# Altium project PB-F-0212 Fusion- SUPI Payload.PrjPcb
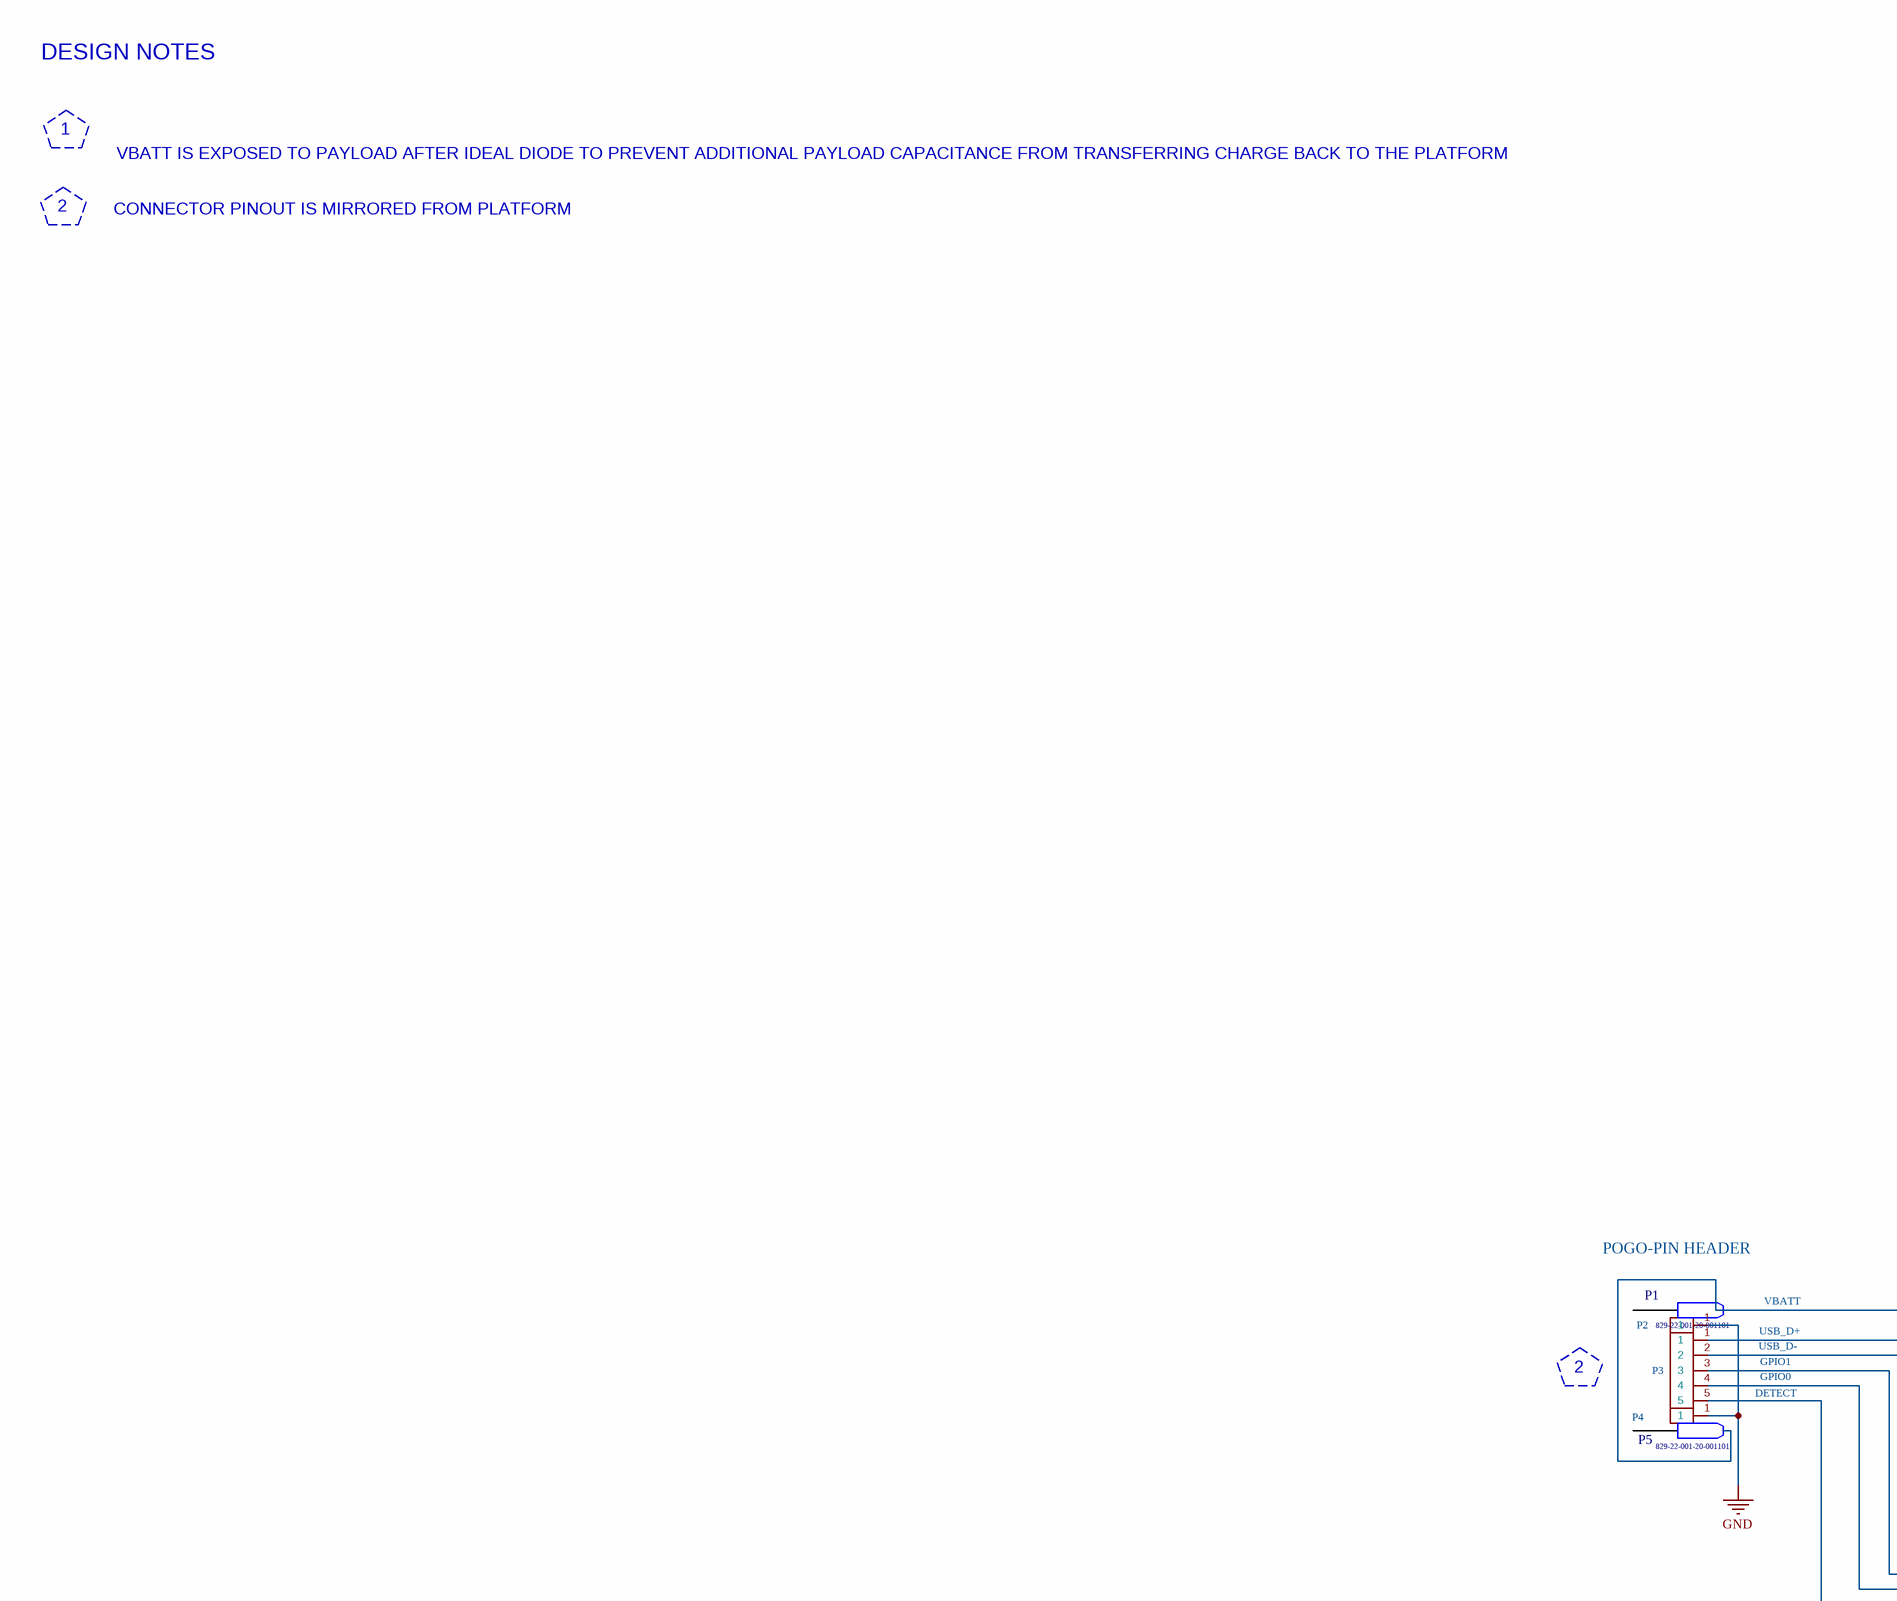
[diagram p0: 100068622_block_diagram.SchDoc, left]
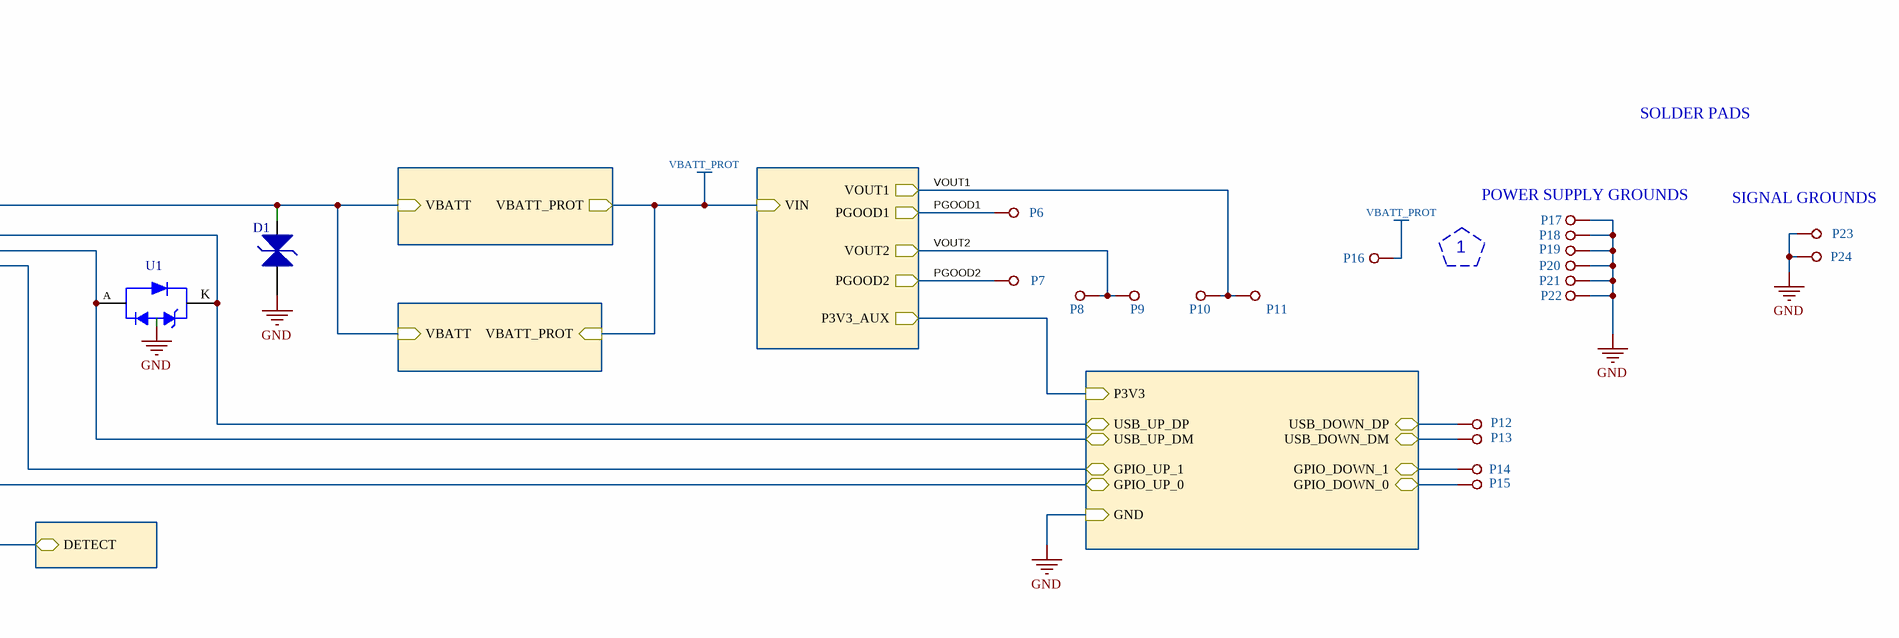
[diagram p1: 100068622_block_diagram.SchDoc, right]
Part_Number: PB-F-0209
6 sheets, 88 parts. Net scope: hierarchical (ports join the sheet entries above them; power ports are global).
Board file: 100068622-001_Rev1.PcbDoc
Sheets:
  100068622_block_diagram.SchDoc
    Power Supplies = 100068622_power_supplies.SchDoc
    Payload Detect = 100068622_payload_detect.SchDoc
    Ideal Diode = 100068622_ideal_diode.SchDoc
    Rail Discharge = 100068622_rail_discharge.SchDoc
    Data Switches = 100068622_data_switches.SchDoc

## Sheet 100068622_block_diagram.SchDoc
size 863 x 558 mm; SheetNumber: 1; SheetTotal: 6

### Parts
D1  SMF26A  [DI-SOD123F-A]  (value not drawn)
P1  (no value)  [829-22-001-20-001101-Footprint-1]
P2  ~  [829-22-001-20-002101]  (value not drawn)
P3  ~  [829-22-005-20-001101]  (value not drawn)
P4  ~  [829-22-001-20-002101]  (value not drawn)
P5  (no value)  [829-22-001-20-001101-Footprint-1]
P6  ~  [Hand_Solder_Pad_100x80_mil]  (value not drawn)
P7  ~  [Hand_Solder_Pad_100x80_mil]  (value not drawn)
P8  ~  [Hand_Solder_Pad_100x80_mil]  (value not drawn)
P9  ~  [Hand_Solder_Pad_100x80_mil]  (value not drawn)
P10  ~  [Hand_Solder_Pad_100x80_mil]  (value not drawn)
P11  ~  [Hand_Solder_Pad_100x80_mil]  (value not drawn)
P12  ~  [Hand_Solder_Pad_100x80_mil]  (value not drawn)
P13  ~  [Hand_Solder_Pad_100x80_mil]  (value not drawn)
P14  ~  [Hand_Solder_Pad_100x80_mil]  (value not drawn)
P15  ~  [Hand_Solder_Pad_100x80_mil]  (value not drawn)
P16  ~  [Hand_Solder_Pad_200x150_mil]  (value not drawn)
P17  ~  [Hand_Solder_Pad_100x80_mil]  (value not drawn)
P18  (no value)  [Hand_Solder_Pad_100x80_mil]
P19  (no value)  [Hand_Solder_Pad_100x80_mil]
P20  (no value)  [Hand_Solder_Pad_100x80_mil]
P21  ~  [Hand_Solder_Pad_100x80_mil]  (value not drawn)
P22  ~  [Hand_Solder_Pad_200x150_mil]  (value not drawn)
P23  ~  [Hand_Solder_Pad_100x80_mil]  (value not drawn)
P24  ~  [Hand_Solder_Pad_100x80_mil]  (value not drawn)
U1  PESD5V0C2UM  [IC-SOT883-2-B]  (value not drawn)

### Sub-sheets
Data Switches = 100068622_data_switches.SchDoc: P3V3 (in), GND (in), USB_DOWN_DP (bidir), USB_DOWN_DM (bidir), USB_UP_DM (bidir), USB_UP_DP (bidir), GPIO_DOWN_1 (bidir), GPIO_DOWN_0 (bidir), GPIO_UP_1 (bidir), GPIO_UP_0 (bidir)
Ideal Diode = 100068622_ideal_diode.SchDoc: VBATT (in), VBATT_PROT (out)
Payload Detect = 100068622_payload_detect.SchDoc: DETECT (bidir)
Power Supplies = 100068622_power_supplies.SchDoc: VIN (in), VOUT1 (out), VOUT2 (out), PGOOD1 (out), PGOOD2 (out), P3V3_AUX (out)
Rail Discharge = 100068622_rail_discharge.SchDoc: VBATT (in), VBATT_PROT (in)

### Nets
GND: D1.A P2.1 P4.1 P17.1 P18.1 P19.1 P20.1 P21.1 P22.1 P23.1 P24.1 ; sheet Data Switches/GND
VBATT_PROT: P16.1 ; sheet Power Supplies/VIN, sheet Ideal Diode/VBATT_PROT, sheet Rail Discharge/VBATT_PROT
DETECT: P3.5 ; sheet Payload Detect/DETECT
PGOOD1: P6.1 ; sheet Power Supplies/PGOOD1
PGOOD2: P7.1 ; sheet Power Supplies/PGOOD2
VOUT1: P10.1 P11.1 ; sheet Power Supplies/VOUT1
VOUT2: P8.1 P9.1 ; sheet Power Supplies/VOUT2
NetC8_2: sheet Power Supplies/P3V3_AUX, sheet Data Switches/P3V3
NetC21_2: D1.K ; sheet Ideal Diode/VBATT, sheet Rail Discharge/VBATT
NetP3_1: P3.1 U1.K ; sheet Data Switches/USB_UP_DP
NetP3_2: P3.2 U1.A ; sheet Data Switches/USB_UP_DM
NetP3_3: P3.3 ; sheet Data Switches/GPIO_UP_1
NetP3_4: P3.4 ; sheet Data Switches/GPIO_UP_0
NetP12_1: P12.1 ; sheet Data Switches/USB_DOWN_DP
NetP13_1: P13.1 ; sheet Data Switches/USB_DOWN_DM
NetP14_1: P14.1 ; sheet Data Switches/GPIO_DOWN_1
NetP15_1: P15.1 ; sheet Data Switches/GPIO_DOWN_0

Not connected (* = marked no-connect by the designer): P1 0; P5 0

### Notes on the sheet
- DESIGN NOTES
- 1
- VBATT IS EXPOSED TO PAYLOAD AFTER IDEAL DIODE TO PREVENT
  ADDITIONAL PAYLOAD CAPACITANCE FROM TRANSFERRING CHARGE
  BACK TO THE PLATFORM
- 2
- CONNECTOR PINOUT IS MIRRORED FROM PLATFORM
- POGO-PIN HEADER
- SOLDER PADS
- (near P17) POWER SUPPLY GROUNDS
- (near P23) SIGNAL GROUNDS
- Labels drawn without touching a wire or pin: GPIO0, GPIO1, USB_D+, USB_D-, VBATT
- DWG NO
- REVISIONS
- SH
- REVISION
- DESCRIPTION
- DATE(YEAR-MO-DA)
- APPROVED
- PART NO.
- DESIGN ACTIVITY
- US ARMY
  COMBAT CAPABILITIES DEVELOPMENT COMMAND ARMAMENTS CENTER
  PICATINNY ARSENAL, NEW JERSEY 07806-5000
- SIZE
- CAGE CODE
- DWG NO.
- D
- 19200
- SCALE
- NONE
- UNIT WT.
- ---
- SHEET
- (in symbol CONN-00404-1) 829-22-001-20-001101

### Library data of the parts
D1 = CMP-00657-1: SMF Series 200 W 26 V Uni-Directional Surface Mount TVS Diode - SOD-123F; Breakdown Voltage: 30.4V; Clamping Voltage: 42.1V; Max Breakdown Voltage: 31.9V; Max Power Dissipation: 1W; Max Reverse Leakage Current: 1µA; Max Surge Current: 4.8A; Min Breakdown Voltage: 28.9V; Number of Channels: 1; Peak Pulse Power: 1kW; Polarity: Unidirectional; Power Line Protection: No; Reverse Standoff Voltage: 26V; Test Current: 1mA; Footprint: 1a_Littelfuse:SOD-123FL; Composition: Zener; Lead Free: Lead Free; Lifecycle Status: Production; Max Operating Temperature: 150°C; Min Operating Temperature: -65°C; Mounting Technology: Surface Mount; Number of Elements: 1; Number of Terminals: 2; Number of Unidirectional Channels: 1; Packaging: Cut Tape; Peak Pulse Current: 4.8A; Peak Reverse Current: 1µA; REACH SVHC: No; Reverse Voltage: 26V; RoHS: Compliant; Schedule B: 8541100080; Termination: SMD/SMT
P1 P5 = CONN-00404-1: Conn Spring Loaded Connector HDR 1 POS Solder RA Thru-Hole 1.14mm MidStroke; Leader Qty: 5; Number of Contacts: 1; Pitch: 2.54mm; Footprint: 1a_MillMax:829-22-001-20-001101; Case/Package: SIP; Contact Gender: Male; Contact Plating: Gold; Country of Origin: USA; Lifecycle Status: Production; Mounting Technology: Through Hole; Number of Rows: 1; System: Connector; Termination: Through Hole
P2 P4 = 829-22-001-20-002101: Manufacturer: Mill-Max; MPN: 829-22-001-20-002101; Footprint: 1a_MillMax:829-22-001-20-002101
P3 = 829-22-005-20-001101: Manufacturer: Mill-Max; MPN: 829-22-005-20-001101; Footprint: 1a_MillMax:829-22-005-20-001101
P6-P15 P17-P21 P23 P24 = Hand_Solder_Pad_100x80_mil: Footprint: 1a_Misc:Hand_Solder_Pad_100x80_mil
P16 P22 = Hand_Solder_Pad_200x100_mil: Footprint: 1a_Misc:Hand_Solder_Pad_200x150_mil
U1 = CMP-00652-1: Extremely low capacitance unidirectional ESD protection diode array; Manufacturer Lifecycle Status: RELEASED FOR SUPPLY; Footprint: Package_DFN_QFN:Diodes_DFN1006-3; Lifecycle Status: Production

## Sheet 100068622_power_supplies.SchDoc
size 863 x 558 mm; SheetNumber: 5; SheetTotal: 6
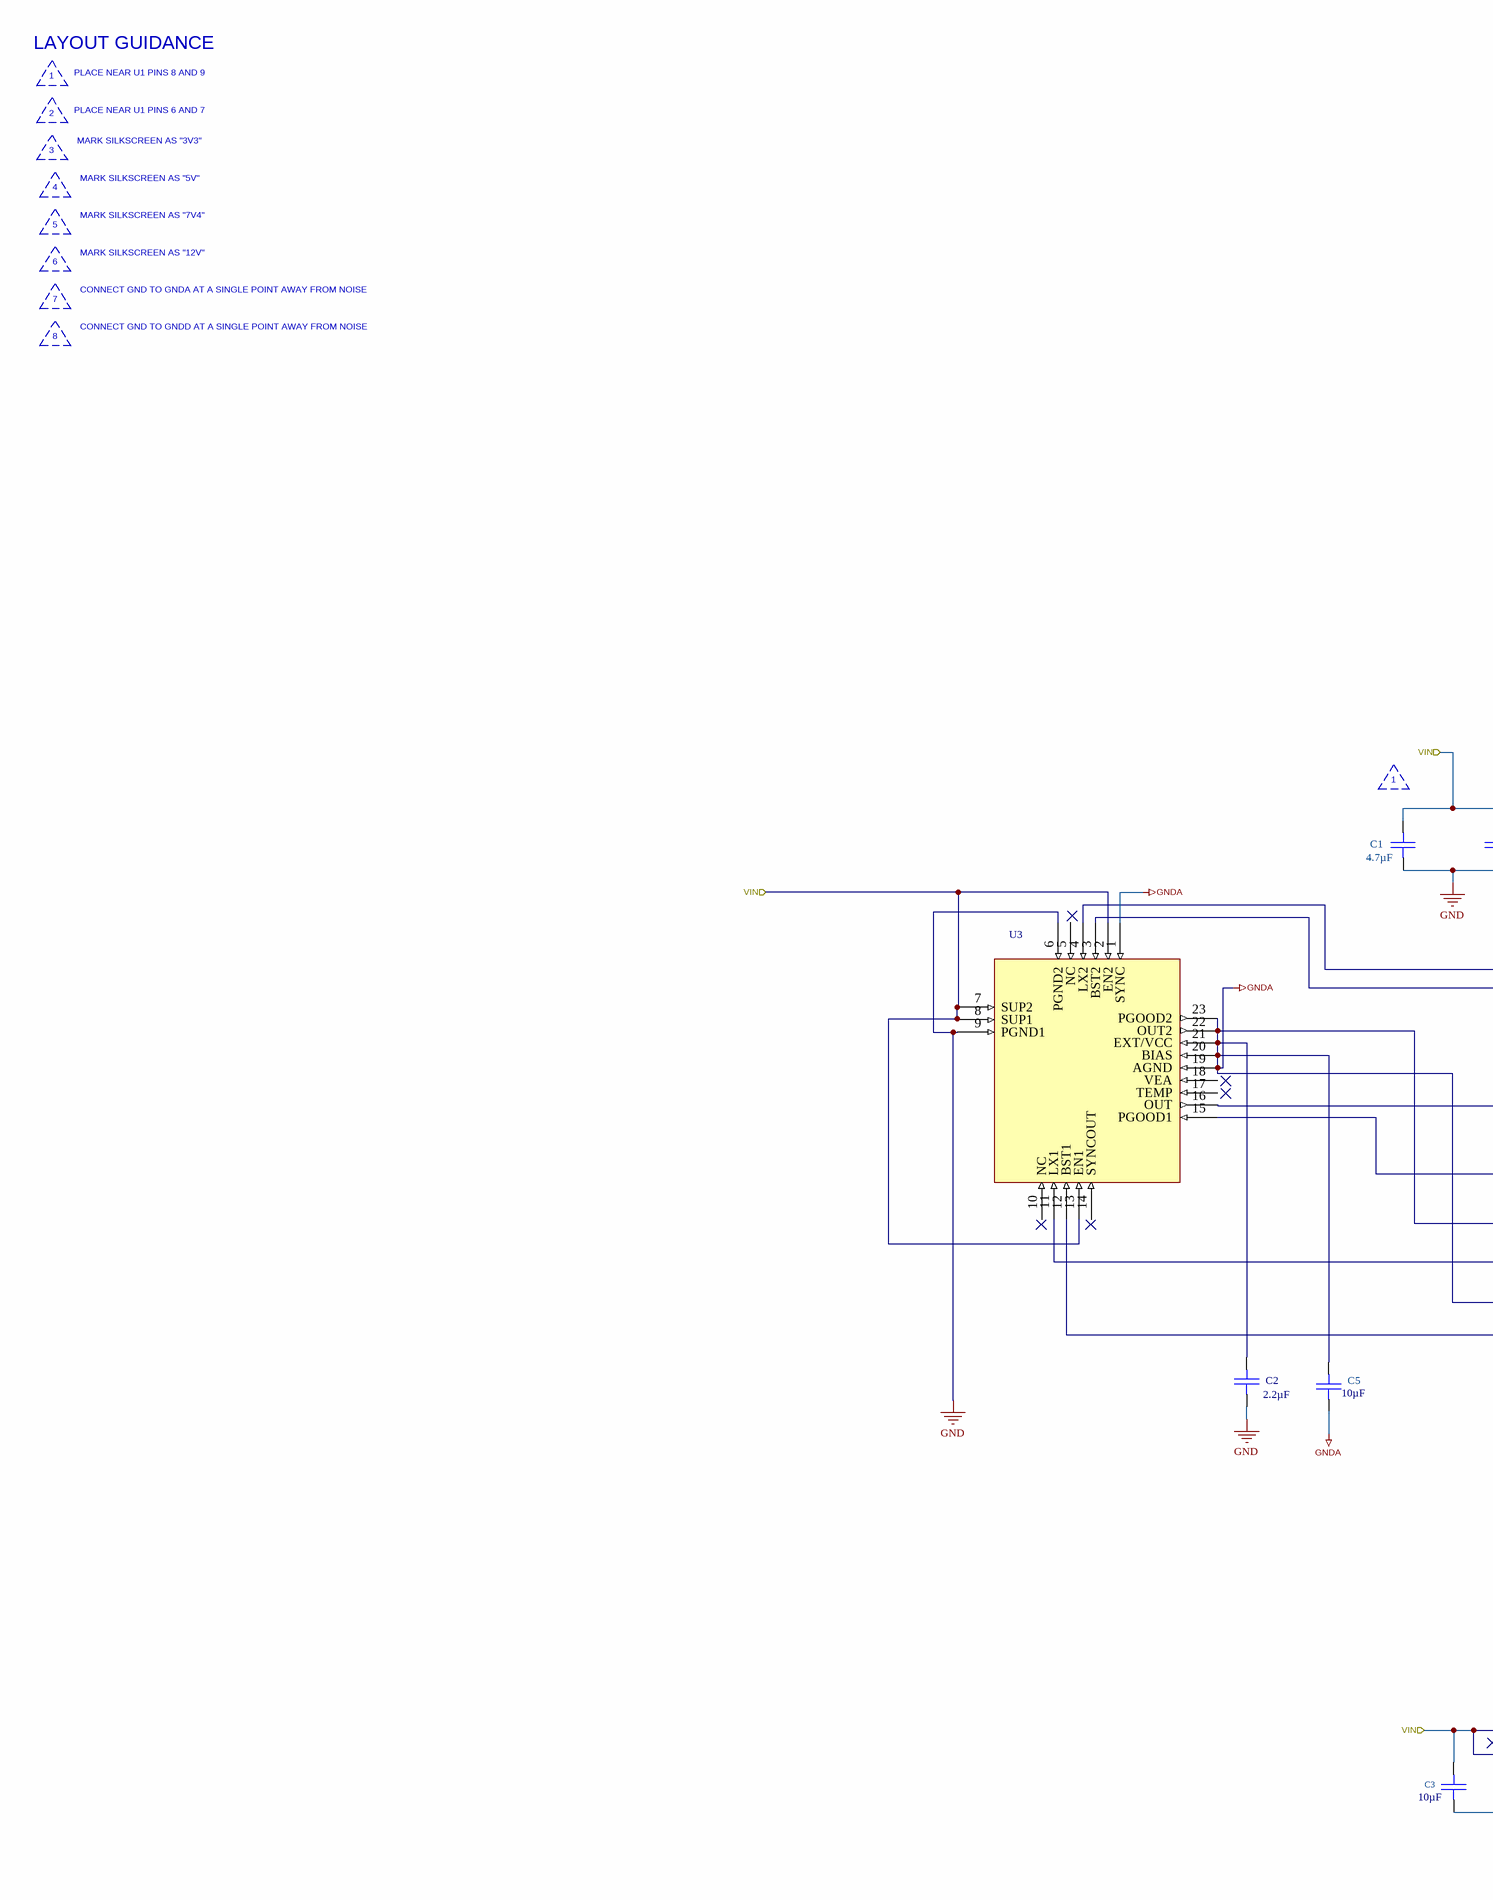
[diagram p2: 100068622_power_supplies.SchDoc, left]
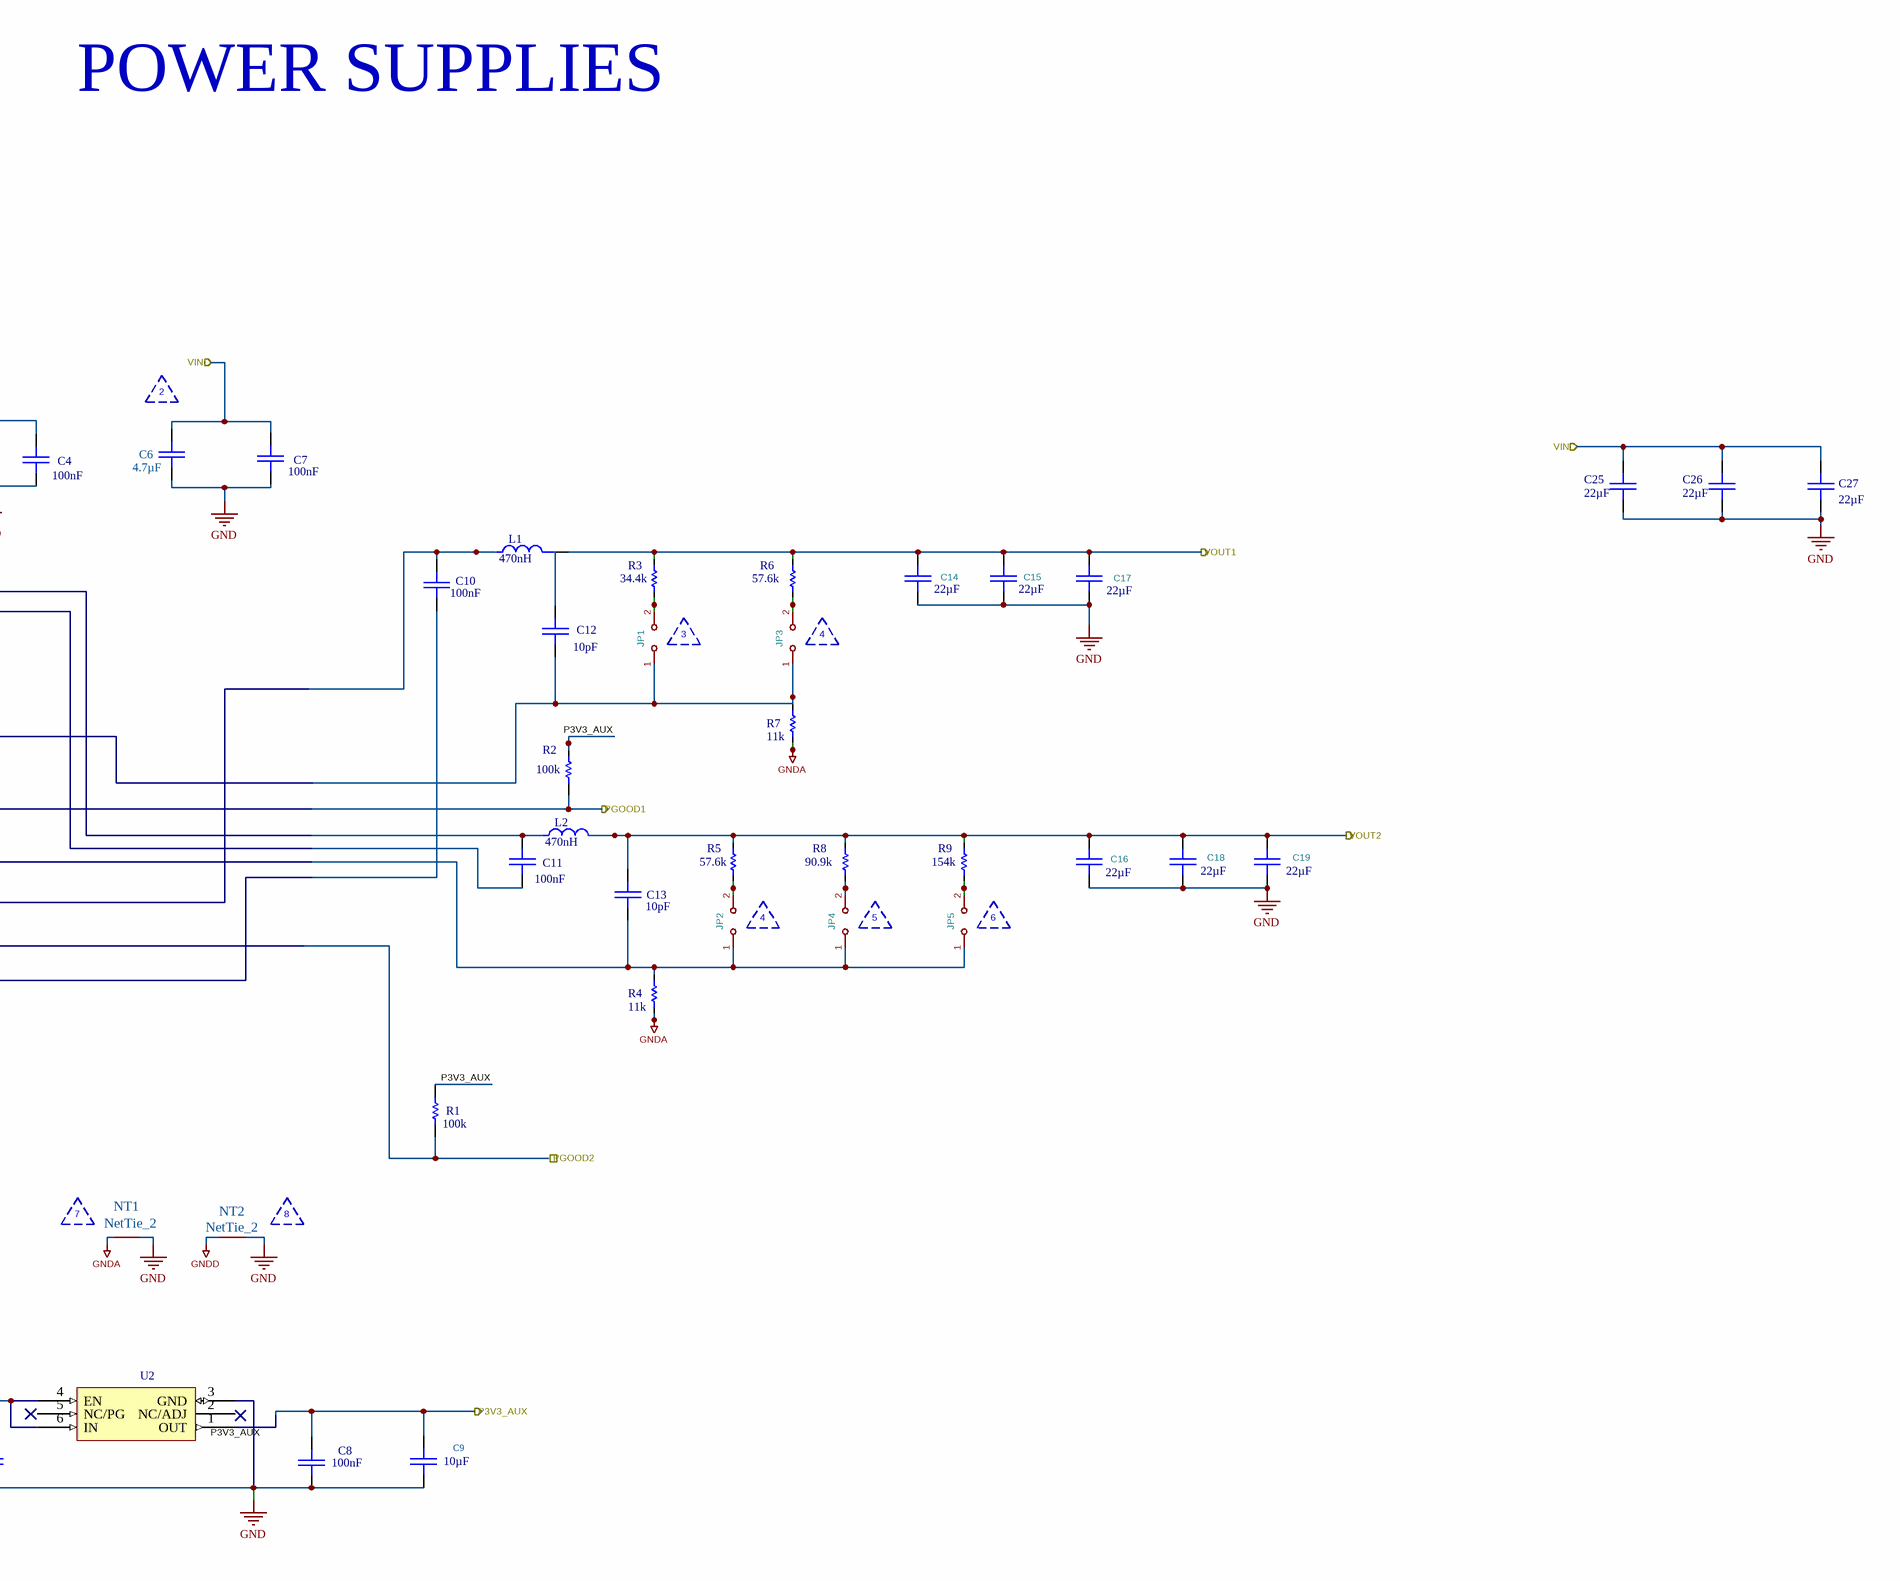
[diagram p3: 100068622_power_supplies.SchDoc, right]

### Parts
C1  value 4.7µF  [CAP-0805-A]  (hidden comment: CAP 0805 4.7UF 50V 10% X7R)
C2  value 2.2µF  [CAP-0402-A]  (hidden comment: CAP 0402 2.2UF 35V 10% X5R)
C3  value 10µF  [CAP-0805-A]  (hidden comment: CAP 0805 10UF 50V 10% X5R)
C4  value 100nF  [CAP-0402-A]  (hidden comment: CAP 0402 0.1UF 50V 10% X5R)
C5  value 10µF  [CAP-0402-A]  (hidden comment: Cap 0402 10uF 10V 20% X5R)
C6  value 4.7µF  [CAP-0805-A]  (hidden comment: CAP 0805 4.7UF 50V 10% X7R)
C7  value 100nF  [CAP-0402-A]  (hidden comment: CAP 0402 0.1UF 50V 10% X5R)
C8  value 100nF  [CAP-0402-A]  (hidden comment: CAP 0402 0.1UF 50V 10% X5R)
C9  value 10µF  [CAP-0402-A]  (hidden comment: Cap 0402 10uF 10V 20% X5R)
C10  value 100nF  [CAP-0402-A]  (hidden comment: CAP 0402 0.1UF 50V 10% X5R)
C11  value 100nF  [CAP-0402-A]  (hidden comment: CAP 0402 0.1UF 50V 10% X5R)
C12  value 10pF  [CAP-0402-A]  (hidden comment: CAP 0402 10pF 50V 2% NPO)
C13  value 10pF  [CAP-0402-A]  (hidden comment: CAP 0402 10pF 50V 2% NPO)
C14  value 22µF  [CAP-0805-A]  (hidden comment: Cap 0805 22uF 25V 20% X5R)
C15  value 22µF  [CAP-0805-A]  (hidden comment: Cap 0805 22uF 25V 20% X5R)
C16  value 22µF  [CAP-0805-A]  (hidden comment: Cap 0805 22uF 25V 20% X5R)
C17  value 22µF  [CAP-0805-A]  (hidden comment: Cap 0805 22uF 25V 20% X5R)
C18  value 22µF  [CAP-0805-A]  (hidden comment: Cap 0805 22uF 25V 20% X5R)
C19  value 22µF  [CAP-0805-A]  (hidden comment: Cap 0805 22uF 25V 20% X5R)
C25  value 22µF  [CAP-0805-A]  (hidden comment: CAP 0805 22UF 35V 20%)
C26  value 22µF  [CAP-0805-A]  (hidden comment: CAP 0805 22UF 35V 20%)
C27  value 22µF  [CAP-0805-A]  (hidden comment: CAP 0805 22UF 35V 20%)
JP1  Jumper_2_Bridged  [SolderJumper-2_P1.3mm_Open_TrianglePad1.0x1.5mm]  (value not drawn)
JP2  Jumper_2_Bridged  [SolderJumper-2_P1.3mm_Open_TrianglePad1.0x1.5mm]  (value not drawn)
JP3  Jumper_2_Open  [SolderJumper-2_P1.3mm_Open_TrianglePad1.0x1.5mm]  (value not drawn)
JP4  Jumper_2_Open  [SolderJumper-2_P1.3mm_Open_TrianglePad1.0x1.5mm]  (value not drawn)
JP5  Jumper_2_Open  [SolderJumper-2_P1.3mm_Open_TrianglePad1.0x1.5mm]  (value not drawn)
L1  value 470nH  [IND-1616-A]  (hidden comment: XEL4030-471MEC)
L2  value 470nH  [IND-1616-A]  (hidden comment: XEL4030-471MEC)
NT1  NetTie_2  [NetTie segment - 10 mils horizontal]
NT2  NetTie_2  [NetTie segment - 10 mils horizontal]
R1  value 100k  [RES-0402-C]  (hidden comment: Res 0402 100K 1/10W 1% Thick Flim)
R2  value 100k  [RES-0402-C]  (hidden comment: Res 0402 100K 1/10W 1% Thick Flim)
R3  value 34.4k  [RES-0402-A]  (hidden comment: RES 0402 34.4K 1/16W 1%)
R4  value 11k  [RES-0402-C]  (hidden comment: RES 0402 11K 1/10W 1%)
R5  value 57.6k  [RES-0402-A]  (hidden comment: RES 0402 57.6K 1/10W 1%)
R6  value 57.6k  [RES-0402-A]  (hidden comment: RES 0402 57.6K 1/10W 1%)
R7  value 11k  [RES-0402-C]  (hidden comment: RES 0402 11K 1/10W 1%)
R8  value 90.9k  [RES-0402-A]  (hidden comment: RES 0402 90.9K 1/10W 1%)
R9  value 154k  [RES-0402-A]  (hidden comment: Res 0402 154K 1/10W 1% Thick Flim)
U2  NCP730BMT330TBG  [IC-WDFN6-B]  (value not drawn)
U3  MAX25254AFDE_VY+  [IC-FC2QFN23-A]  (value not drawn)

### Ports
P3V3_AUX (out), PGOOD1 (out), PGOOD2 (out), VIN (in), VOUT1 (out), VOUT2 (out)

### Nets
GND: C1.1 C2.1 C3.1 C4.1 C6.1 C7.1 C8.1 C9.1 C14.1 C15.1 C16.1 C17.1 C18.1 C19.1 C25.1 C26.1 C27.1 NT1.2 NT2.2 U2.3(GND) U3.6(PGND2) U3.9(PGND1)
GNDA: C2.2 C5.1 C5.2 C13.1 JP2.1(A) JP4.1(A) JP5.1(A) NT1.1 R1.2 R4.1 R4.2 R7.1 U3.1(SYNC) U3.19(AGND) U3.20(BIAS) U3.21(EXT/VCC) U3.22(OUT2) U3.23(PGOOD2)
GNDD: NT2.1
VBATT_PROT: C1.2 C3.2 C4.2 C6.2 C7.2 C25.2 C26.2 C27.2 U2.4(EN) U2.6(IN) U3.2(EN2) U3.7(SUP2) U3.8(SUP1) U3.13(EN1) ; port VIN
P3V3_AUX: R1.1 R2.2
PGOOD1: R2.1 U3.15(PGOOD1) ; port PGOOD1
VOUT1: C14.2 C15.2 C17.2 L1.2 R3.2 R6.2 ; port VOUT1
VOUT2: C13.2 C16.2 C18.2 C19.2 L2.2 R5.2 R8.2 R9.2 ; port VOUT2
NetC8_2: C8.2 C9.2 U2.1(OUT) ; port P3V3_AUX
NetC10_1: C10.1 U3.12(BST1)
NetC10_2: C10.2 L1.1 U3.11(LX1)
NetC11_1: C11.1 U3.3(BST2)
NetC11_2: C11.2 L2.1 U3.4(LX2)
NetC12_1: C12.1 JP1.1(A) JP3.1(A) R7.2 U3.16(OUT)
NetJP1_2: JP1.2(B) R3.1
NetJP2_2: JP2.2(B) R5.1
NetJP3_2: JP3.2(B) R6.1
NetJP4_2: JP4.2(B) R8.1
NetJP5_2: JP5.2(B) R9.1

Not connected (* = marked no-connect by the designer): C12 2; U2 2(NC/ADJ) 5(NC/PG); U3 5(NC) 10(NC) 14(SYNCOUT) 17(TEMP) 18(VEA)

### Notes on the sheet
- LAYOUT GUIDANCE
- 1
- PLACE NEAR U1 PINS 8 AND 9
- 2
- 3
- PLACE NEAR U1 PINS 6 AND 7
- MARK SILKSCREEN AS "3V3"
- 4
- MARK SILKSCREEN AS "5V"
- MARK SILKSCREEN AS "7V4"
- 6
- 5
- MARK SILKSCREEN AS "12V"
- 8
- 7
- CONNECT GND TO GNDA AT A SINGLE POINT AWAY FROM NOISE
- CONNECT GND TO GNDD AT A SINGLE POINT AWAY FROM NOISE
- POWER SUPPLIES
- (near C1) 1
- (near C6) 2
- (near JP1) 3
- (near JP3) 4
- (near JP2) 4
- (near JP4) 5
- (near JP5) 6
- (near NT1) 7
- Labels drawn without touching a wire or pin: P3V3_AUX
- DWG NO
- REVISIONS
- SH
- REVISION
- DESCRIPTION
- DATE(YEAR-MO-DA)
- APPROVED
- PART NO.
- DESIGN ACTIVITY
- US ARMY
  COMBAT CAPABILITIES DEVELOPMENT COMMAND ARMAMENTS CENTER
  PICATINNY ARSENAL, NEW JERSEY 07806-5000
- SIZE
- CAGE CODE
- DWG NO.
- D
- 19200
- SCALE
- NONE
- UNIT WT.
- ---
- SHEET

### Library data of the parts
C1 C6 = CAP-00372-1: Leader Qty: 100; UOM: EA; Footprint: Capacitor_SMD:C_0805_2012Metric; Case/Package: 0805; Max Operating Temperature: 125°C; Min Operating Temperature: -55°C; Mounting Technology: Surface Mount; Voltage Rating: 50V
C2 = CAP-00383-1: Capacitor Type: Ceramic; Leader Qty: 100; UOM: EA; Footprint: Capacitor_SMD:C_0402_1005Metric; Case/Package: 0402; Max Operating Temperature: 85°C; Min Operating Temperature: -55°C; Mounting Technology: Surface Mount; Pins: 2; RoHS Compliant: Yes; Tolerance: 10%; Voltage Rating: 35V
C3 = CAP-00370-1: Leader Qty: 100; UOM: EA; Footprint: Capacitor_SMD:C_0805_2012Metric; Case/Package: 0805; Dielectric: X5R; Max Operating Temperature: 85°C; Min Operating Temperature: -55°C; Mounting Technology: Surface Mount
C4 C7 C8 C10 C11 = CAP-00349-1: Capacitor Type: Ceramic; Leader Qty: 100; UOM: EA; Footprint: Capacitor_SMD:C_0402_1005Metric; Case/Package: 0402; Max Operating Temperature: 85°C; Min Operating Temperature: -55°C; Mounting Technology: Surface Mount; Pins: 2; RoHS Compliant: Yes; Tolerance: 10%; Voltage Rating: 50V
C5 C9 = CAP-00021-6: Capacitor Type: Ceramic; Leader Qty: 100; Footprint: Capacitor_SMD:C_0402_1005Metric; Case/Package: 0402; Max Operating Temperature: 85°C; Min Operating Temperature: -55°C; Mounting Technology: SMT; Pins: 2; RoHS Compliant: Yes; Tolerance: 20%; Voltage Rating: 10V
C12 C13 = CAP-00136-5: Cap Ceramic 10pF 50V C0G 2% Pad SMD 0402 125°C T/R; Leader Qty: 100; Footprint: Capacitor_SMD:C_0402_1005Metric; Case/Package: 0402; Max Operating Temperature: 125°C; Min Operating Temperature: -55°C; RoHS Compliant: Yes; Tolerance: 2%; Voltage Rating: 50V
C14-C19 = CMP-00053-15: Capacitor Type: Ceramic; Leader Qty: 100; Footprint: Capacitor_SMD:C_0805_2012Metric; Case/Package: 0805; Max Operating Temperature: 85°C; Min Operating Temperature: -55°C; Mounting Technology: Surface Mount; Series: -; Tolerance: 20%; Voltage Rating: 25V
C25-C27 = CAP-00374-1: Leader Qty: 100; Material: Ceramic; UOM: EA; Footprint: Capacitor_SMD:C_0805_2012Metric; Case/Package: 0805; Length: 2mm; Max Length: 2.2mm; Max Operating Temperature: 85°C; Min Operating Temperature: -55°C; Mounting Technology: Surface Mount; Tolerance: 20%; Voltage Rating: 35V
L1 L2 = CMP-00659-1: General Purpose Inductor, 0.47uH, 20%, 1 Element, Composite-Core, SMD, 1616; DC Resistance (DCR): 4.6mΩ; Max Current Rating: 15.6A; Number of Circuits: 1; Self Resonant Frequency: 95MHz; Test Frequency: 1MHz; Footprint: 1a_Misc:XEL4030-3.1mm; Case/Package: 1616; Core Material: Composite; Country of Origin: Mainland China; Export Control Classification Number (ECCN) Code: EAR99; Harmonized Tariff Schedule (HTS) Code: 8504.50.80.00; Height: 3.1mm; Introduction Date: 2016-01-23; Lifecycle Status: Production; Max Operating Temperature: 125°C; Min Operating Temperature: -40°C; Number of Terminals: 2; REACH SVHC: Yes; RoHS: Compliant; Tolerance: 20%; Width: 4mm
R1 R2 = RES-00031-9: Leader Qty: 100; Footprint: Resistor_SMD:R_0402_1005Metric; Case/Package: 0402; Max Operating Temperature: 155°C; Min Operating Temperature: -55°C; Mounting Technology: SMT; Pins: 2; RoHS Compliant: Yes; Tolerance: 1%
R3 = RES-00791-1: Leader Qty: 100; UOM: EA; Voltage Rating: 50V; Footprint: Resistor_SMD:R_0402_1005Metric; Case/Package: 0402; Max Operating Temperature: 155°C; Min Operating Temperature: -55°C; Mounting Technology: Surface Mount; Tolerance: 1%
R4 R7 = RES-00793-1: Leader Qty: 100; Power Dissipation: 100mW; UOM: EA; Voltage Rating: 75V; Footprint: Resistor_SMD:R_0402_1005Metric; Case/Package: 0402; Case Code (Imperial): 0402; Height: 350µm; Length: 1mm; Lifecycle Status: Production; Max Operating Temperature: 155°C; Min Operating Temperature: -55°C; Mounting Technology: Surface Mount; Power Rating: 100mW; Termination: SMD/SMT; Tolerance: 1%; Working Voltage: 75V
R5 R6 = RES-00794-1: Leader Qty: 100; UOM: EA; Voltage Rating (DC): 50V; Footprint: Resistor_SMD:R_0402_1005Metric; Case/Package: 0402; Case Code (Imperial): 0402; Height: 350µm; Length: 1mm; Lifecycle Status: Production; Max Operating Temperature: 155°C; Min Operating Temperature: -55°C; Mounting Technology: Surface Mount; Tolerance: 1%; Voltage Rating: 50V
R8 = RES-00795-1: Leader Qty: 100; UOM: EA; Voltage Rating: 75V; Footprint: Resistor_SMD:R_0402_1005Metric; Case/Package: 0402; Case Code (Imperial): 0402; Max Operating Temperature: 155°C; Min Operating Temperature: -55°C; Mounting Technology: Surface Mount; Tolerance: 1%; Working Voltage: 75V
R9 = RES-00028-9: Leader Qty: 100; Footprint: Resistor_SMD:R_0402_1005Metric; Case/Package: 0402; Max Operating Temperature: 155°C; Min Operating Temperature: -55°C; Mounting Technology: SMT; Pins: 2; RoHS Compliant: Yes; Tolerance: 1%
U2 = IC-00416-1: LDO Regulator, 150 mA, 38 V, 1 uA IQ, with PG 3V3 HZ, WDFN6 2x2; Manufacturer Lifecycle Status: ACTIVE; Accuracy: 1%; Dropout Voltage: 290mV; Max Junction Temperature (Tj): 125°C; Max Supply Voltage: 38V; Min Input Voltage: 4.3V; Number of Channels: 1; Output Current: 150mA; Output Voltage: 3.3V; Voltage Tolerance: 2%; Footprint: 1a_Misc:WDFN6_2x2_0.65p_1.72x1.12mm_EP; China RoHS: Compliant; Export Control Classification Number (ECCN) Code: EAR99; Harmonized Tariff Schedule (HTS) Code: 8542.39.00.60; Height - Seated (Max): 800µm; Height: 800µm; Introduction Date: 2019-11-13; Length: 2mm; Lifecycle Status: Production; Max Operating Temperature: 150°C; Min Supply Voltage: 4.3V; Number of Circuits: 1; Number of Outputs: 1; Number of Terminals: 6; REACH SVHC: Yes; RoHS: Compliant; Terminal Pitch: 650µm; Width: 2mm
U3 = CMP-00667-1: Dual 36V Input Voltage, 8A Synchronous Buck Converters with Multiphase Capability and ASIL B Safety Level; Manufacturer Lifecycle Status: PRODUCTION; Footprint: 1a_Misc:F234A5FY+1; Lifecycle Status: Production
JP1 JP2 = Jumper_2_Bridged: Value: Jumper_2_Bridged; Footprint: Jumper:SolderJumper-2_P1.3mm_Open_TrianglePad1.0x1.5mm
JP3-JP5 = Jumper_2_Open: Value: Jumper_2_Open; Footprint: Jumper:SolderJumper-2_P1.3mm_Open_TrianglePad1.0x1.5mm
NT1 NT2 = NetTie_2: Value: NetTie_2; Footprint: 1a_Misc:NetTie segment - 10 mils horizontal

## Sheet 100068622_payload_detect.SchDoc
size 863 x 558 mm; SheetNumber: 4; SheetTotal: 6
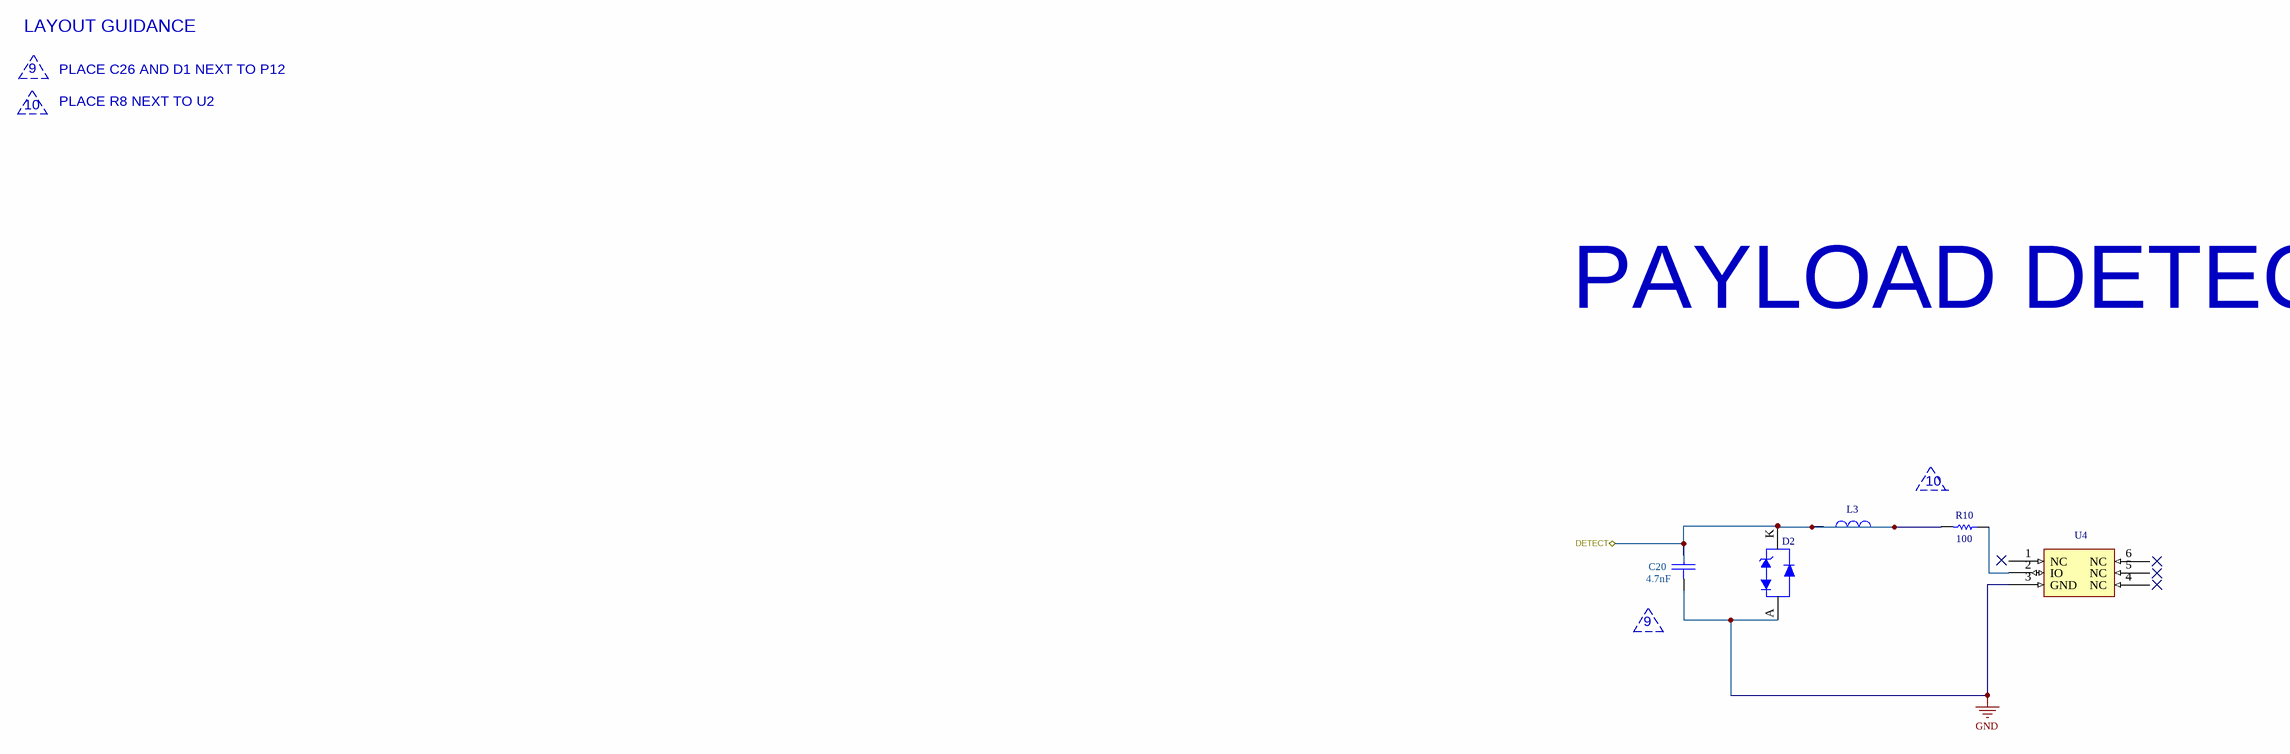
[diagram p4: 100068622_payload_detect.SchDoc]

### Parts
C20  value 4.7nF  [CAP-0402-A]  (hidden comment: CAP 0402 4700PF 50V 10% X7R)
D2  SMF3.3  [DI-SOD123F-A]  (value not drawn)
L3  MDF2016BSS270C  [IND-0806-A]  (value not drawn)
R10  value 100  [RES-0402-B]  (hidden comment: Res 0402 100 Ohm 0.1W 1% Thick Film)
U4  DS2431Q-TR  [IC-TDFN3X3-B]  (value not drawn)

### Ports
DETECT (bidir)

### Nets
GND: C20.1 D2.A U4.3(GND)
DETECT: C20.2 D2.K L3.1 L3.2 R10.1 ; port DETECT
NetR10_2: R10.2 U4.2(IO)

Not connected (* = marked no-connect by the designer): U4 1(NC) 4(NC) 5(NC) 6(NC)

### Notes on the sheet
- LAYOUT GUIDANCE
- 10
- 9
- PLACE R8 NEXT TO U2
- PLACE C26 AND D1 NEXT TO P12
- PAYLOAD DETECT
- DWG NO
- REVISIONS
- SH
- REVISION
- DESCRIPTION
- DATE(YEAR-MO-DA)
- APPROVED
- PART NO.
- DESIGN ACTIVITY
- US ARMY
  COMBAT CAPABILITIES DEVELOPMENT COMMAND ARMAMENTS CENTER
  PICATINNY ARSENAL, NEW JERSEY 07806-5000
- SIZE
- CAGE CODE
- DWG NO.
- D
- 19200
- SCALE
- NONE
- UNIT WT.
- ---
- SHEET

### Library data of the parts
C20 = CAP-00371-1: Leader Qty: 100; UOM: EA; Footprint: Capacitor_SMD:C_0402_1005Metric; Case/Package: 0402; Max Operating Temperature: 150°C; Min Operating Temperature: -55°C; Mounting Technology: Surface Mount; Tolerance: 10%
D2 = CMP-00658-1: ESD protection diodes / TVS diodes; LITTELFUSE; SMF3.3; 6.8 V; 30 A; 3.3 V; 3.4 V - 4.3 V; Breakdown Voltage: 3.85V; Clamping Voltage: 6.8V; Direction: Unidirectional; Forward Voltage: 16V; Max Breakdown Voltage: 4.3V; Max Junction Temperature (Tj): 150°C; Max Power Dissipation: 1.7W; Max Reverse Leakage Current: 500nA; Min Breakdown Voltage: 3.4V; Number of Channels: 1; Peak Pulse Current: 30A; Peak Pulse Power: 200W; Reverse Standoff Voltage: 3.3V; Test Current: 10mA; Footprint: 1a_Littelfuse:SOD-123FL; Country of Origin: Mainland China; Export Control Classification Number (ECCN) Code: EAR99; Harmonized Tariff Schedule (HTS) Code: 8541.10.00.50; Height: 1.08mm; Introduction Date: 2016-08-01; Lifecycle Status: Production; Max Operating Temperature: 150°C; Min Operating Temperature: -55°C; Number of Elements: 1; Number of Terminals: 2; Packaging: Cut Tape; Peak Reverse Current: 500nA; Polarity: Unidirectional; REACH SVHC: No; Reverse Voltage: 3.3V; RoHS: Compliant; Schedule B: 8541100080
L3 = CMP-00660-1: Ferrite Bead, Aec-Q200, 0806, 1A Rohs Compliant: Yes; Manufacturer Lifecycle Status: PRODUCTION; DC Resistance (DCR): 220mΩ; Impedance: 27Ω; Number of Circuits: 1; Footprint: 1a_Misc:0806 SMD; Current Rating: 1A; Export Control Classification Number (ECCN) Code: EAR99; Harmonized Tariff Schedule (HTS) Code: 8504.50.80.00; Height: 1mm; Introduction Date: 2021-03-10; Length: 2mm; Lifecycle Status: Production; Max Length: 2.2mm; Max Operating Temperature: 125°C; Max Width: 1.8mm; Min Length: 1.8mm; Min Operating Temperature: -40°C; Min Width: 1.4mm; Number of Terminals: 2; REACH SVHC: Yes; RoHS: Compliant; Width: 1.6mm
R10 = RES-00021-9: Power: 100mW; Voltage Rating: 100V; Footprint: Resistor_SMD:R_0402_1005Metric; Case/Package: 0402; Leader Qty: 100; Max Operating Temperature: 155°C; Min Operating Temperature: -55°C; Mounting Technology: SMD; Pins: 2; Tolerance: 1%
U4 = IC-00419-1: IC EEPROM 1KBIT 1-WIRE 6TDFN; Manufacturer Lifecycle Status: PRODUCTION; Density: 1kb; Interface: Serial; Max Supply Voltage: 5.25V; Memory Size: 128B; Min Supply Voltage: 2.8V; Footprint: Package_DFN_QFN:Maxim_TDFN-6-1EP_3x3mm_P0.95mm_EP1.5x2.3mm; Contact Plating: Tin; Lifecycle Status: Production; Max Operating Temperature: 85°C; Memory Format: EEPROM; Min Operating Temperature: -40°C; Pins: 6; Radiation Hardening: No; REACH SVHC: Unknown; RoHS: Compliant; Schedule B: 8542320050|8542320050|8542320050|8542320050|8542320050

## Sheet 100068622_ideal_diode.SchDoc
size 863 x 558 mm; SheetNumber: 3; SheetTotal: 6
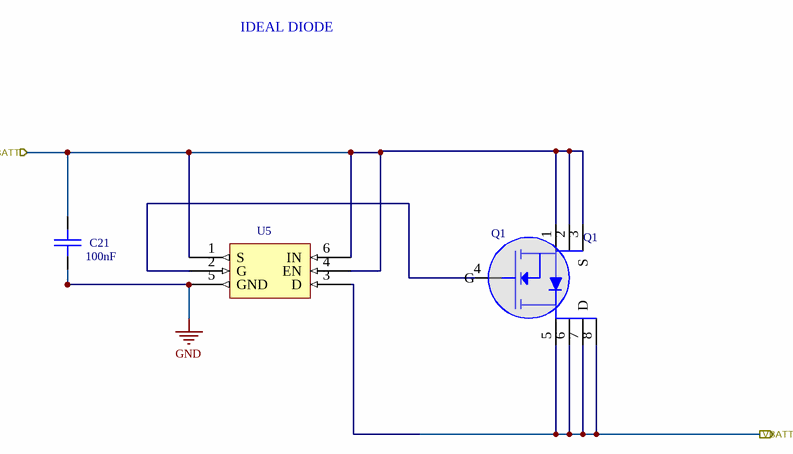
[diagram p5: 100068622_ideal_diode.SchDoc]

### Parts
C21  value 100nF  [CAP-0402-A]  (hidden comment: CAP 0402 0.1UF 50V 10% X5R)
Q1  MOSFET - SINGLE - N CHANNEL - 8PIN  [IC-8PQFN-A]  (value not drawn)
U5  NCV68261MTWAITBG  [IC-WDFN6-C]  (value not drawn)

### Ports
VBATT (in), VBATT_PROT (out)

### Nets
GND: C21.1 U5.5(GND)
VBATT_PROT: Q1.5(D) Q1.6(D) Q1.7(D) Q1.8(D) U5.3(D) ; port VBATT_PROT
NetC21_2: C21.2 Q1.1(S) Q1.2(S) Q1.3(S) U5.1(S) U5.4(EN) U5.6(IN) ; port VBATT
NetQ1_4: Q1.4(G) U5.2(G)

### Notes on the sheet
- IDEAL DIODE
- (near Q1) Q1
- DWG NO
- REVISIONS
- SH
- REVISION
- DESCRIPTION
- DATE(YEAR-MO-DA)
- APPROVED
- PART NO.
- DESIGN ACTIVITY
- US ARMY
  COMBAT CAPABILITIES DEVELOPMENT COMMAND ARMAMENTS CENTER
  PICATINNY ARSENAL, NEW JERSEY 07806-5000
- SIZE
- CAGE CODE
- DWG NO.
- D
- 19200
- SCALE
- NONE
- UNIT WT.
- ---
- SHEET

### Library data of the parts
C21 = CAP-00349-1: as C4 on sheet 100068622_power_supplies; Footprint: Capacitor_SMD:C_0402_1005Metric; Case/Package: 0402; Max Operating Temperature: 85°C; Min Operating Temperature: -55°C; Mounting Technology: Surface Mount; Pins: 2; RoHS Compliant: Yes; Tolerance: 10%; Voltage Rating: 50V
Q1 = CMP-00665-5: Transistor MOSFET N-Channel 40V 150A 8-Pin PQFN T/R; Manufacturer Lifecycle Status: ACTIVE; Drain to Source Resistance: 2.1mΩ; Gate to Source Voltage (Vgs): 20V; Max Junction Temperature (Tj): 150°C; Max Power Dissipation: 83W; Number of Channels: 1; Power Dissipation: 2.2W; Turn-Off Delay Time: 32ns; Turn-On Delay Time: 17ns; China RoHS: Non-Compliant; Continuous Drain Current (ID): 150A; Country of Origin: Philippines; Drain to Source Breakdown Voltage: 40V; Drain to Source Voltage (Vdss): 40V; Export Control Classification Number (ECCN) Code: EAR99; Height: 800µm; Introduction Date: 2019-11-12; Lifecycle Status: Production; Max Operating Temperature: 150°C; Min Breakdown Voltage: 40V; Min Operating Temperature: -55°C; Number of Elements: 1; Number of Terminals: 8; REACH SVHC: No; RoHS: Compliant; Schedule B: 8541290080, 8541290080
U5 = IC-00420-1: OR Controller N-Channel Single 2.4Ohm Automotive 6-Pin WDFNW EP T/R; Footprint: 1a_Misc:WDFNW6_2x2_0.65p_EP; China RoHS: Compliant; Export Control Classification Number (ECCN) Code: EAR99; Harmonized Tariff Schedule (HTS) Code: 8542.39.00.60; Introduction Date: 2022-02-25; Lifecycle Status: Production; REACH SVHC: Yes; RoHS: Compliant

## Sheet 100068622_rail_discharge.SchDoc
size 863 x 558 mm; SheetNumber: 6; SheetTotal: 6
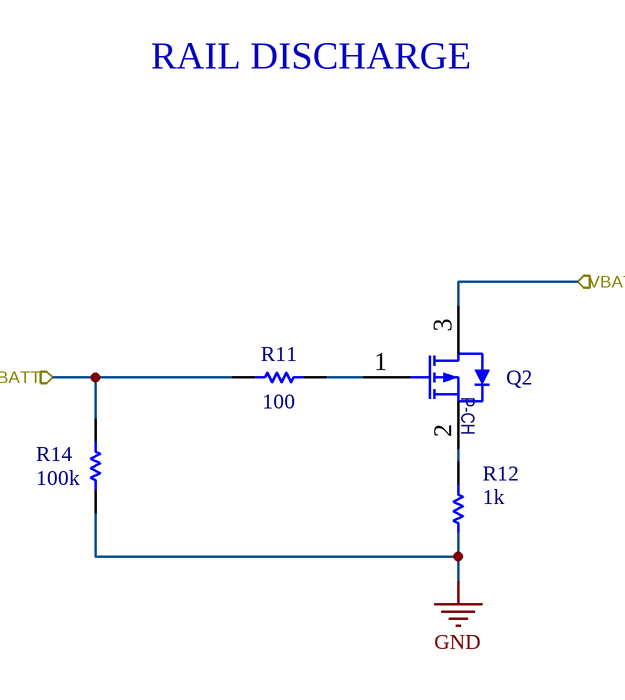
[diagram p6: 100068622_rail_discharge.SchDoc]

### Parts
Q2  DMP610DL-13  [IC-SOT23-3-A]  (value not drawn)
R11  value 100  [RES-0402-B]  (hidden comment: Res 0402 100 Ohm 0.1W 1% Thick Film)
R12  value 1k  [RES-2512-C]  (hidden comment: Resistor)
R14  value 100k  [RES-0402-C]  (hidden comment: Res 0402 100K 1/10W 1% Thick Flim)

### Ports
VBATT (in), VBATT_PROT (in)

### Nets
GND: R12.1 R14.1
VBATT_PROT: Q2.3(D) ; port VBATT_PROT
NetC21_2: R11.2 R14.2 ; port VBATT
NetQ2_1: Q2.1(G) R11.1
NetQ2_2: Q2.2(S) R12.2

### Notes on the sheet
- RAIL DISCHARGE
- DWG NO
- REVISIONS
- SH
- REVISION
- DESCRIPTION
- DATE(YEAR-MO-DA)
- APPROVED
- PART NO.
- DESIGN ACTIVITY
- US ARMY
  COMBAT CAPABILITIES DEVELOPMENT COMMAND ARMAMENTS CENTER
  PICATINNY ARSENAL, NEW JERSEY 07806-5000
- SIZE
- CAGE CODE
- DWG NO.
- D
- 19200
- SCALE
- NONE
- UNIT WT.
- ---
- SHEET
- (in symbol CMP-00655-1) P-CH

### Library data of the parts
Q2 = CMP-00655-1: Trans Mosfet P-ch 60V 0.18A 3-PIN SOT-23 T/r; Continuous Drain Current (ID): 180mA; Drain to Source Resistance: 10Ω; Number of Elements: 1; Power Dissipation: 500mW; Footprint: Package_TO_SOT_SMD:SOT-23; China RoHS: Compliant; Country of Origin: Mainland China; Export Control Classification Number (ECCN) Code: EAR99; Harmonized Tariff Schedule (HTS) Code: 8541.21.00.95; Introduction Date: 2018-02-27; Lifecycle Status: Production; Max Operating Temperature: 150°C; Min Breakdown Voltage: 60V; Min Operating Temperature: -55°C; Number of Terminals: 3; REACH SVHC: Yes; RoHS: Compliant
R11 = RES-00021-9: Power: 100mW; Voltage Rating: 100V; Footprint: Resistor_SMD:R_0402_1005Metric; Case/Package: 0402; Leader Qty: 100; Max Operating Temperature: 155°C; Min Operating Temperature: -55°C; Mounting Technology: SMD; Pins: 2; Tolerance: 1%
R12 = RES-00796-1: Res Thick Film 2512 1K Ohm 1% 1W ±100ppm/C Pad SMD T/R Automotive AEC-Q200; Leader Qty: 100; UOM: EA; Voltage Rating: 200V; Footprint: 1a_CommonPassives:R_2512_HandSoldering; Case/Package: 2512; Composition: Thick Film; Height: 600µm; Lifecycle Status: Production; Max Operating Temperature: 155°C; Min Operating Temperature: -55°C; Mounting Technology: Surface Mount; Power Rating: 1W; Working Voltage: 200V
R14 = RES-00031-9: Leader Qty: 100; Footprint: Resistor_SMD:R_0402_1005Metric; Case/Package: 0402; Max Operating Temperature: 155°C; Min Operating Temperature: -55°C; Mounting Technology: SMT; Pins: 2; RoHS Compliant: Yes; Tolerance: 1%

## Sheet 100068622_data_switches.SchDoc
size 863 x 558 mm; SheetNumber: 2; SheetTotal: 6
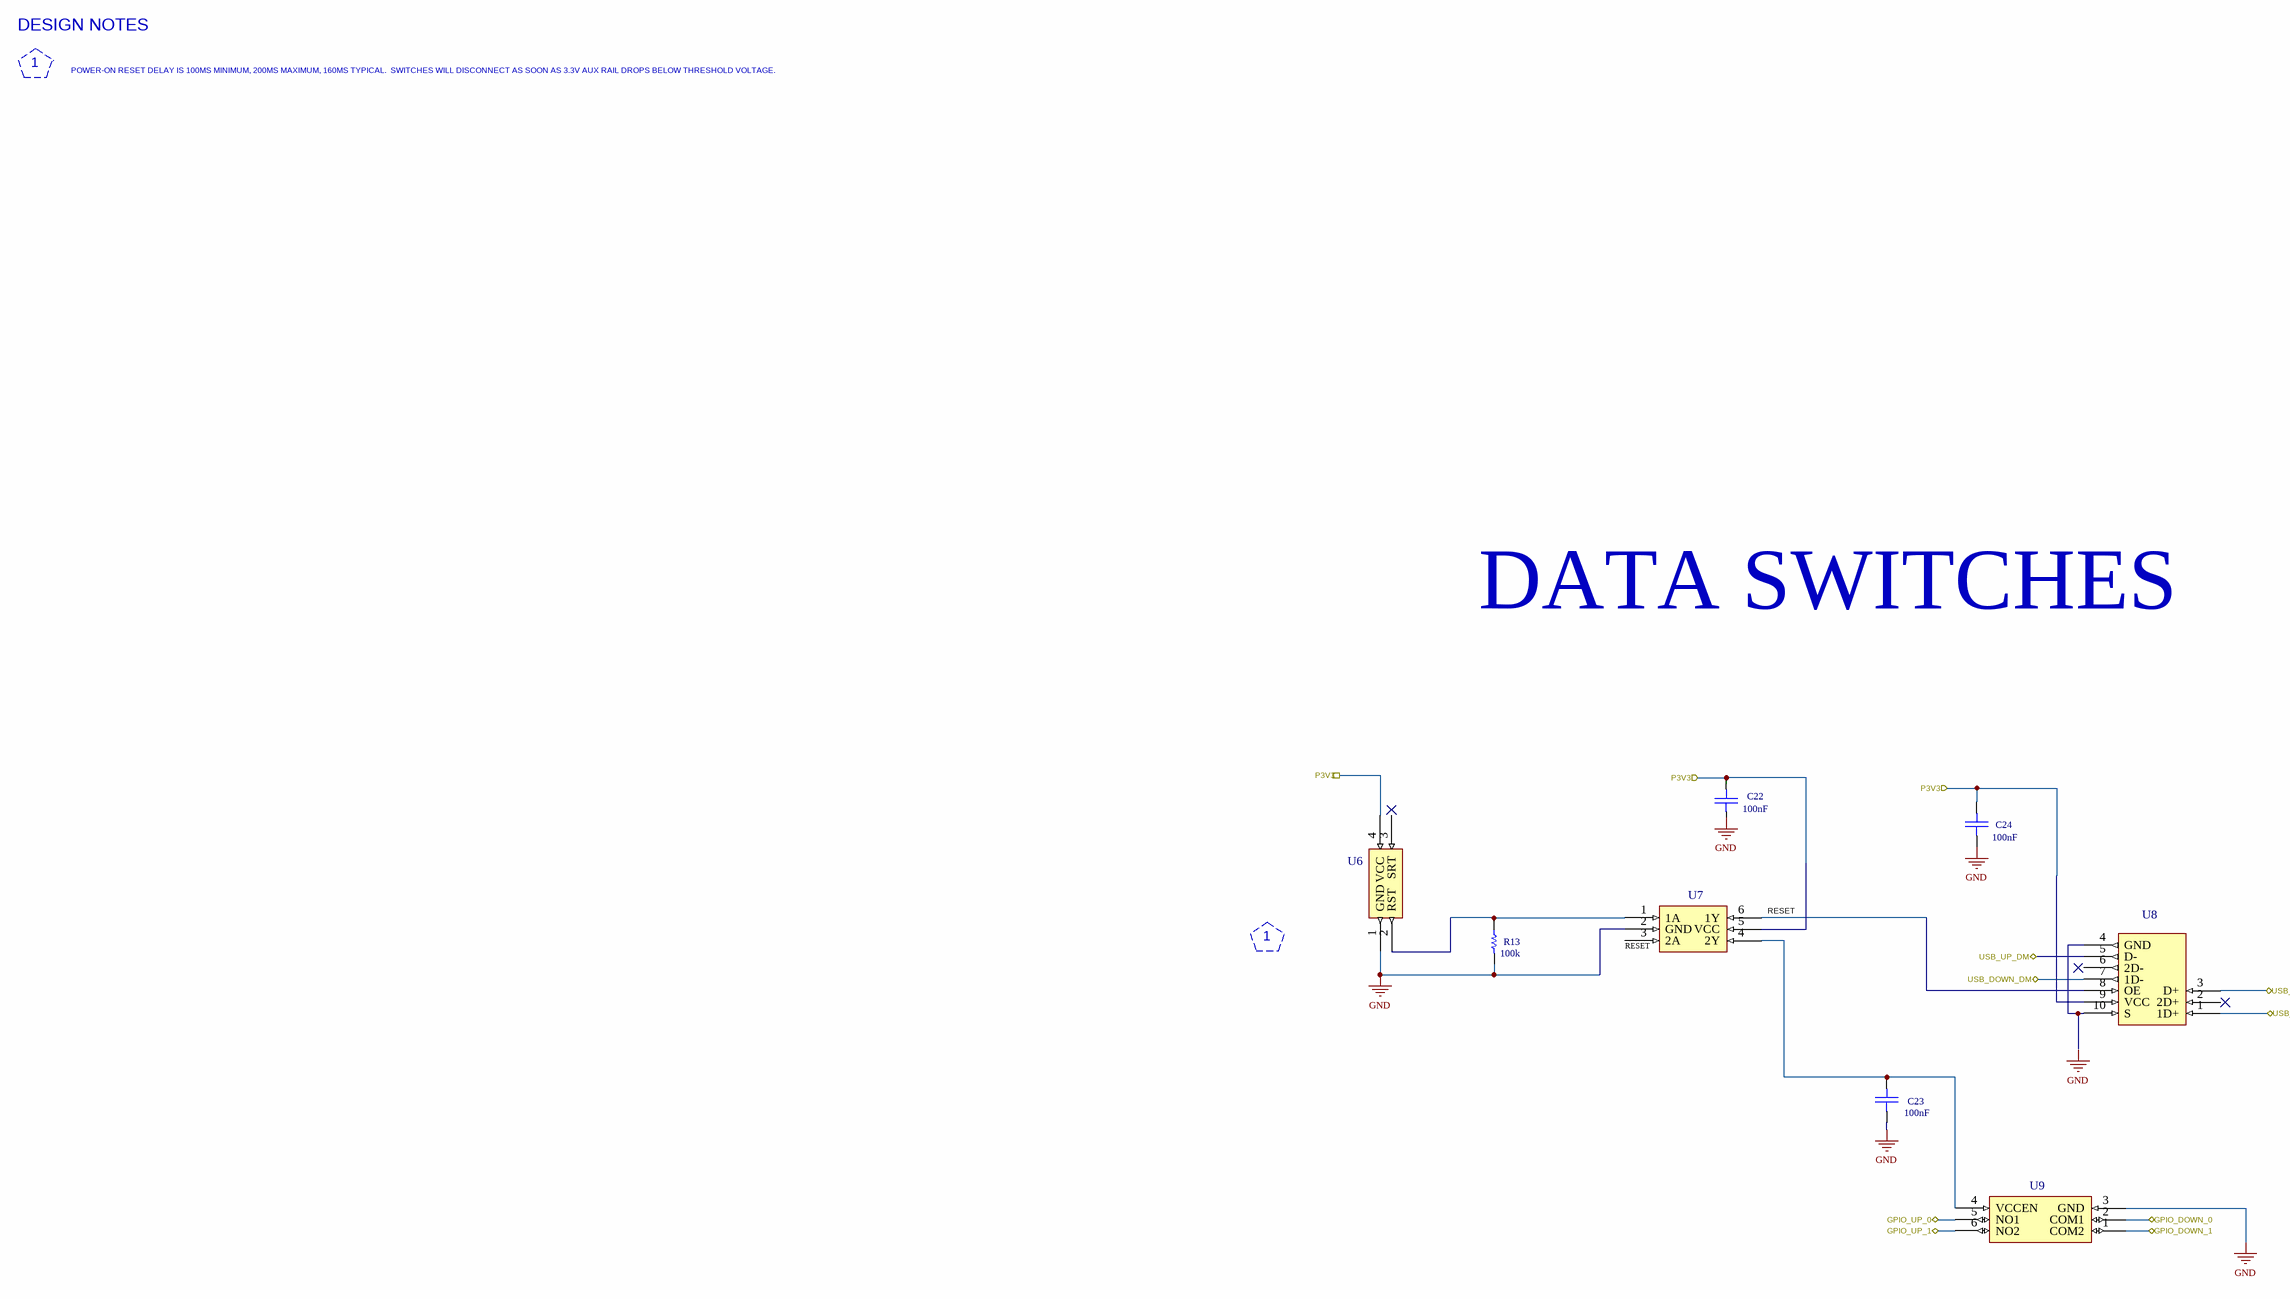
[diagram p7: 100068622_data_switches.SchDoc]

### Parts
C22  value 100nF  [CAP-0402-A]  (hidden comment: CAP 0402 0.1UF 50V 10% X5R)
C23  value 100nF  [CAP-0402-A]  (hidden comment: CAP 0402 0.1UF 50V 10% X5R)
C24  value 100nF  [CAP-0402-A]  (hidden comment: CAP 0402 0.1UF 50V 10% X5R)
R13  value 100k  [RES-0402-C]  (hidden comment: Res 0402 100K 1/10W 1% Thick Flim)
U6  MAX821UUS+T  [IC-SOT143-4-A]  (value not drawn)
U7  SN74AUP2G04DRYR  [IC-SON6-A]  (value not drawn)
U8  TC7USB40MU  [IC-UQFN10-A]  (value not drawn)
U9  MAX20336AEFT+T  [IC-FC2QFN-A]  (value not drawn)

### Ports
GPIO_DOWN_0 (bidir), GPIO_DOWN_1 (bidir), GPIO_UP_0 (bidir), GPIO_UP_1 (bidir), P3V3 (in), USB_DOWN_DM (bidir), USB_DOWN_DP (bidir), USB_UP_DM (bidir), USB_UP_DP (bidir)

### Nets
GND: C23.1 C24.1 R13.1 U6.1(GND) U7.2(GND) U9.3(GND)
NetC8_2: C22.1 C24.2 U7.5(VCC) U8.9(VCC) ; port P3V3
NetC23_2: C23.2 U7.4(2Y) U9.4(VCCEN)
NetP3_1: U8.3(D+) ; port USB_UP_DP
NetP3_3: U9.6(NO2) ; port GPIO_UP_1
NetP3_4: U9.5(NO1) ; port GPIO_UP_0
NetP12_1: U8.1(1D+) ; port USB_DOWN_DP
NetP13_1: U8.7(1D-) ; port USB_DOWN_DM
NetP14_1: U9.1(COM2) ; port GPIO_DOWN_1
NetP15_1: U9.2(COM1) ; port GPIO_DOWN_0
NetR13_2: R13.2 U6.2(RST) U7.1(1A)
NetU7_6: U7.6(1Y) U8.8(OE)
NetU8_4: U8.4(GND) U8.10(S)

Not connected (* = marked no-connect by the designer): C22 2; U6 3(SRT) 4(VCC); U7 3(2A); U8 2(2D+) 5(D-) 6(2D-)

### Notes on the sheet
- DESIGN NOTES
- 1
- POWER-ON RESET DELAY IS 100MS MINIMUM, 200MS MAXIMUM, 160MS
  TYPICAL.  SWITCHES WILL DISCONNECT AS SOON AS 3.3V AUX RAIL
  DROPS BELOW THRESHOLD VOLTAGE.
- DATA SWITCHES
- Labels drawn without touching a wire or pin: GND, RESET
- DWG NO
- REVISIONS
- SH
- REVISION
- DESCRIPTION
- DATE(YEAR-MO-DA)
- APPROVED
- PART NO.
- DESIGN ACTIVITY
- US ARMY
  COMBAT CAPABILITIES DEVELOPMENT COMMAND ARMAMENTS CENTER
  PICATINNY ARSENAL, NEW JERSEY 07806-5000
- SIZE
- CAGE CODE
- DWG NO.
- D
- 19200
- SCALE
- NONE
- UNIT WT.
- ---
- SHEET

### Library data of the parts
C22-C24 = CAP-00349-1: as C4 on sheet 100068622_power_supplies; Footprint: Capacitor_SMD:C_0402_1005Metric; Case/Package: 0402; Max Operating Temperature: 85°C; Min Operating Temperature: -55°C; Mounting Technology: Surface Mount; Pins: 2; RoHS Compliant: Yes; Tolerance: 10%; Voltage Rating: 50V
R13 = RES-00031-9: Leader Qty: 100; Footprint: Resistor_SMD:R_0402_1005Metric; Case/Package: 0402; Max Operating Temperature: 155°C; Min Operating Temperature: -55°C; Mounting Technology: SMT; Pins: 2; RoHS Compliant: Yes; Tolerance: 1%
U6 = IC-00421-1: 4-Pin, µP Voltage Monitors with Pin-Selectable Power-On Reset Timeout Delay; Manufacturer Lifecycle Status: PRODUCTION; Max Power Dissipation: 320mW; Max Reset Threshold Voltage: 2.81V; Max Supply Current: 5.5µA; Max Supply Voltage: 5.5V; Min Reset Threshold Voltage: 2.74V; Min Supply Voltage: 1V; Nominal Supply Current: 1.8µA; Number of Outputs: 1; Output Current: 20mA; Reset: Active Low; Threshold Voltage: 2.78V; Watchdog Timer: No; Footprint: 1a_Misc:SOT-143 Maxim; Case/Package: SOT-143-4; Height: 1.22mm; Lead Free: Lead Free; Lifecycle Status: Production; Max Operating Temperature: 125°C; Min Operating Temperature: -40°C; Mounting Technology: Surface Mount; Number of Voltages Monitored: 1; Operating Supply Current: 5.5µA; Overvoltage Threshold: 2.81V; Pins: 4; Radiation Hardening: No; RoHS: Compliant; Type: Simple Reset/Power-On Reset; Undervoltage Threshold: 2.74V
U7 = IC-00422-1: IC INVERTER 2CH 2-INP 6SON Inverter IC 2 Channel 6-SON (1.45x1); Manufacturer Lifecycle Status: ACTIVE; High Level Output Current: -4mA; Logic Function: Buffer, Inverter; Low Level Output Current: 4mA; Max Supply Voltage: 3.6V; Min Supply Voltage: 800mV; Number of Bits: 2; Number of Inputs: 1; Propagation Delay: 6.2ns; Quiescent Current: 500nA; Turn-On Delay Time: 25.5ns; Footprint: 1a_Misc:QFN-6_1.4x1mm_P0.5mm TI DRY6; Height: 600µm; Lead Free: Lead Free; Length: 1.45mm; Lifecycle Status: Production; Max Operating Temperature: 85°C; Min Operating Temperature: -40°C; Mounting Technology: Surface Mount; Number of Circuits: 2; Number of Elements: 2; Number of Gates: 2; Packaging: Digi-Reel®; Pins: 6; Radiation Hardening: No; RoHS: Compliant; Thickness: 500µm; Width: 1mm
U8 = IC-00423-1: USB Interface, 1: 2 Multiplexer/Demultiplexer Switch, USB 2.0, 2.3 V, 4.3 V, UQFN-B, 10 Pins; Footprint: 1a_Misc:Toshiba UQFN-10_1.4x1.8mm_P0.4mm; Schedule B: 8542390000
U9 = IC-00417-1: Industry's Smallest DPST Can Switch ±5.5V Signals with a Single VCC as Low as 1.6V; Manufacturer Lifecycle Status: PRODUCTION; Footprint: 1a_Misc:FC2QFN-6; Lifecycle Status: Production; RoHS: Compliant

## Nets that join several sheets
GND: 100068622_block_diagram (11 pins), 100068622_power_supplies (22 pins), 100068622_payload_detect (C20.1 D2.A U4.3), 100068622_ideal_diode (C21.1 U5.5), 100068622_rail_discharge (R12.1 R14.1), 100068622_data_switches (6 pins)
VBATT_PROT: 100068622_block_diagram (P16.1), 100068622_power_supplies (14 pins), 100068622_ideal_diode (5 pins), 100068622_rail_discharge (Q2.3)
DETECT: 100068622_block_diagram (P3.5), 100068622_payload_detect (5 pins)
NetC8_2: 100068622_power_supplies (C8.2 C9.2 U2.1), 100068622_data_switches (C22.1 C24.2 U7.5 U8.9)
NetC21_2: 100068622_block_diagram (D1.K), 100068622_ideal_diode (7 pins), 100068622_rail_discharge (R11.2 R14.2)
NetP3_1: 100068622_block_diagram (P3.1 U1.K), 100068622_data_switches (U8.3)
NetP3_3: 100068622_block_diagram (P3.3), 100068622_data_switches (U9.6)
NetP3_4: 100068622_block_diagram (P3.4), 100068622_data_switches (U9.5)
NetP12_1: 100068622_block_diagram (P12.1), 100068622_data_switches (U8.1)
NetP13_1: 100068622_block_diagram (P13.1), 100068622_data_switches (U8.7)
NetP14_1: 100068622_block_diagram (P14.1), 100068622_data_switches (U9.1)
NetP15_1: 100068622_block_diagram (P15.1), 100068622_data_switches (U9.2)
PGOOD1: 100068622_block_diagram (P6.1), 100068622_power_supplies (R2.1 U3.15)
VOUT1: 100068622_block_diagram (P10.1 P11.1), 100068622_power_supplies (6 pins)
VOUT2: 100068622_block_diagram (P8.1 P9.1), 100068622_power_supplies (8 pins)